# Altium schematic sheet ETHERNET_PHY.SchDoc: ETHERNET PHY
size A3; Author: Arman Arvand; SheetNumber: 13; SheetTotal: 21
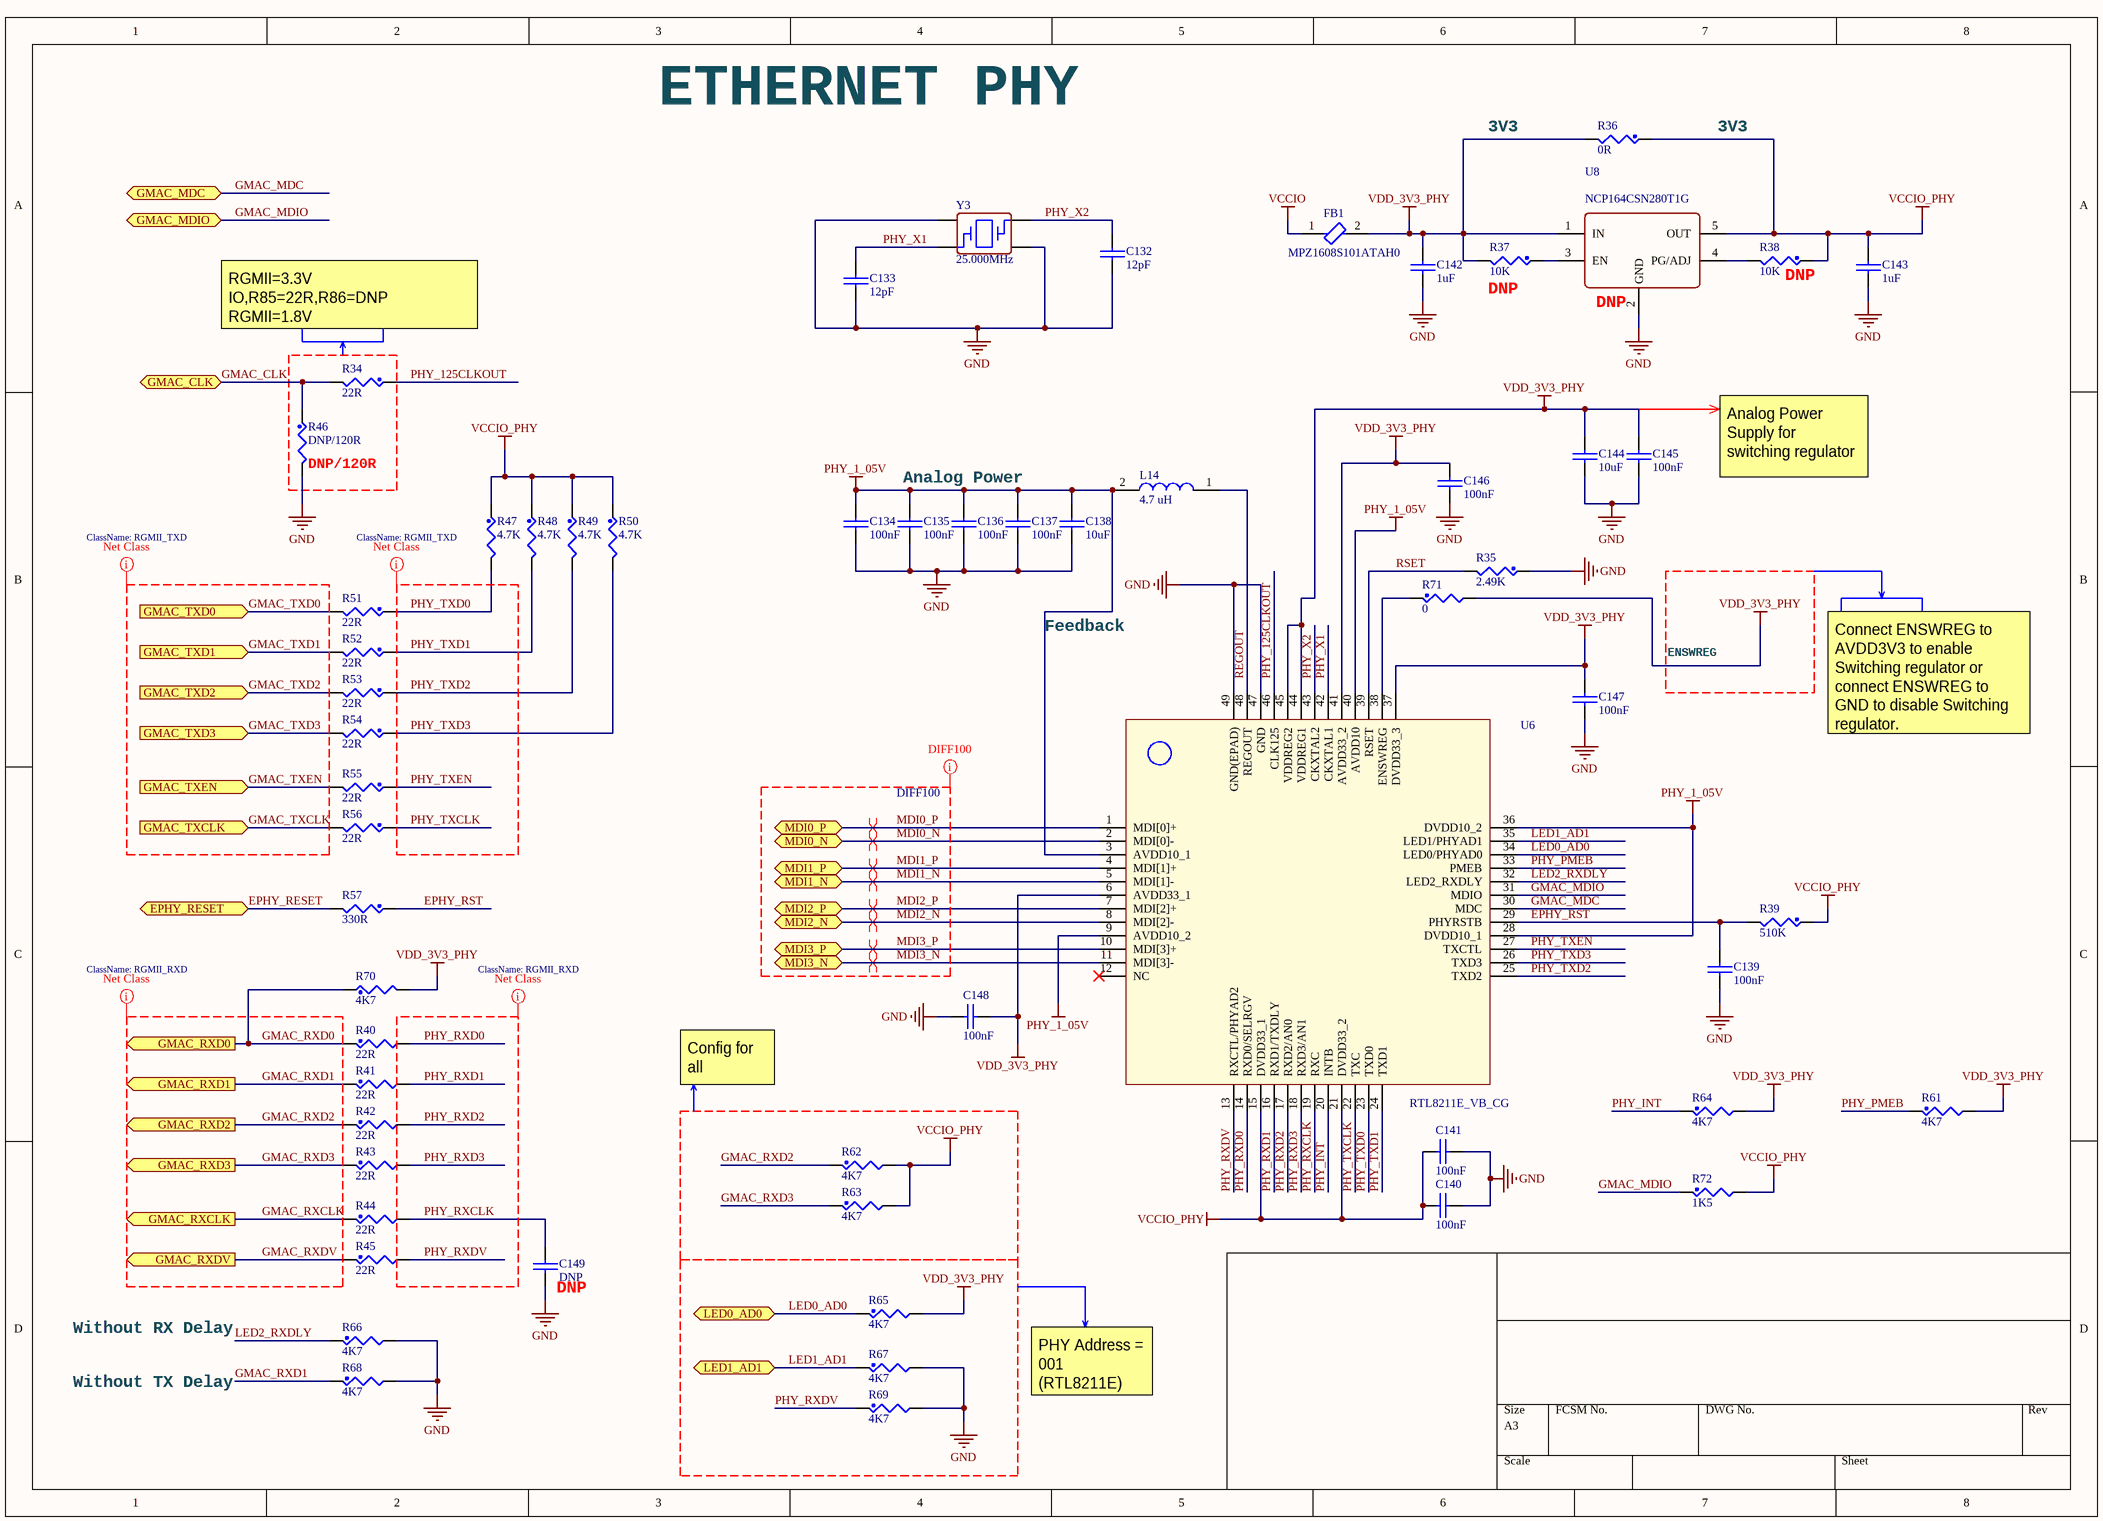
[diagram p0: ETHERNET_PHY.SchDoc]

## Parts
C132  12pF  [0402_CC - C]
C133  12pF  [0402_CC - C]
C134  100nF  [0402_CC - C]
C135  100nF  [0402_CC - C]
C136  100nF  [0402_CC - C]
C137  100nF  [0402_CC - C]
C138  10uF  [0603_CC]
C139  100nF  [0402_CC - C]
C140  100nF  [0402_CC - C]
C141  100nF  [0402_CC - C]
C142  1uF  [0402_CC - C]
C143  1uF  [0402_CC - C]
C144  10uF  [0603_CC]
C145  100nF  [0402_CC - C]
C146  100nF  [0402_CC - C]
C147  100nF  [0402_CC - C]
C148  100nF  [0402_CC - C]
C149  DNP  [0402_CC - C]
FB1  MPZ1608S101ATAH0  [FP-MPZ1608-0_6-IPC_A]
L14  4.7 uH  [1285ASH1R0MP2]
R34  22R  [0402_CR]
R35  2.49K  [0402_CR]
R36  0R  [0402_CR]
R37  10K  [0402_CR]
R38  10K  [0402_CR]
R39  510K  [0402_CR]
R40  22R  [0402_CR]
R41  22R  [0402_CR]
R42  22R  [0402_CR]
R43  22R  [0402_CR]
R44  22R  [0402_CR]
R45  22R  [0402_CR]
R46  DNP/120R  [0402_CR]
R47  4.7K  [0402_CR]
R48  4.7K  [0402_CR]
R49  4.7K  [0402_CR]
R50  4.7K  [0402_CR]
R51  22R  [0402_CR]
R52  22R  [0402_CR]
R53  22R  [0402_CR]
R54  22R  [0402_CR]
R55  22R  [0402_CR]
R56  22R  [0402_CR]
R57  330R  [0402_CR]
R61  4K7  [0402_CR]
R62  4K7  [0402_CR]
R63  4K7  [0402_CR]
R64  4K7  [0402_CR]
R65  4K7  [0402_CR]
R66  4K7  [0402_CR]
R67  4K7  [0402_CR]
R68  4K7  [0402_CR]
R69  4K7  [0402_CR]
R70  4K7  [0402_CR]
R71  0  [0402_CR]
R72  1K5  [0402_CR]
U6  RTL8211E_VB_CG  [QFN40P600X600X100-49N]
U8  NCP164CSN280T1G  [TSOP-5]
Y3  25.000MHz  [ABM8G]

## Blocks framed on the sheet
DNP/120R: R34 R46

## Ports
EPHY_RESET (bidir), GMAC_CLK (bidir), GMAC_MDC (bidir), GMAC_MDIO (bidir), GMAC_RXCLK (out), GMAC_RXD0 (out), GMAC_RXD1 (out), GMAC_RXD2 (out), GMAC_RXD3 (out), GMAC_RXDV (out), GMAC_TXCLK (in), GMAC_TXD0 (in), GMAC_TXD1 (in), GMAC_TXD2 (in), GMAC_TXD3 (in), GMAC_TXEN (in), LED0_AD0 (bidir), LED1_AD1 (bidir), MDI0_N (bidir), MDI0_P (bidir), MDI1_N (bidir), MDI1_P (bidir), MDI2_N (bidir), MDI2_P (bidir), MDI3_N (bidir), MDI3_P (bidir)

## Nets
GND: C132.2 C133.2 C134.2 C135.2 C136.2 C137.2 C138.2 C139.2 C140.2 C141.2 C142.2 C143.2 C144.2 C145.2 C146.1 C147.1 C148.1 C149.1 R35.1 R46.2 R66.2 R67.2 R68.2 R69.2 U6.47(GND) U6.49(GND(EPAD)) U8.2(GND) Y3.2 Y3.4
PHY_1_05V: C134.1 C135.1 C136.1 C137.1 C138.1 L14.2 U6.3(AVDD10_1) U6.9(AVDD10_2) U6.28(DVDD10_1) U6.36(DVDD10_2) U6.40(AVDD10)
VCCIO: FB1.1
VCCIO_PHY: C140.1 C141.1 C143.1 R36.1 R38.1 R39.1 R47.1 R48.1 R49.1 R50.1 R62.2 R63.2 R72.2 U6.15(DVDD33_1) U6.21(DVDD33_2) U8.5(OUT)
VDD_3V3_PHY: C142.1 C144.1 C145.1 C146.2 C147.2 C148.2 FB1.2 R36.2 R37.2 R61.2 R64.2 R65.2 R70.2 R71.2 U6.6(AVDD33_1) U6.37(DVDD33_3) U6.41(AVDD33_2) U6.44(VDDREG1) U6.45(VDDREG2) U8.1(IN)
EPHY_RESET: R57.2 ; port EPHY_RESET
EPHY_RST: C139.1 R39.2 R57.1 U6.29(PHYRSTB)
GMAC_CLK: R34.2 R46.1 ; port GMAC_CLK
GMAC_MDC: U6.30(MDC) ; port GMAC_MDC
GMAC_MDIO: R72.1 U6.31(MDIO) ; port GMAC_MDIO
GMAC_RXCLK: R44.1 ; port GMAC_RXCLK
GMAC_RXD0: R40.1 R70.1 ; port GMAC_RXD0
GMAC_RXD1: R41.1 R68.1 ; port GMAC_RXD1
GMAC_RXD2: R42.1 R62.1 ; port GMAC_RXD2
GMAC_RXD3: R43.1 R63.1 ; port GMAC_RXD3
GMAC_RXDV: R45.1 ; port GMAC_RXDV
GMAC_TXCLK: R56.2 ; port GMAC_TXCLK
GMAC_TXD0: R51.2 ; port GMAC_TXD0
GMAC_TXD1: R52.2 ; port GMAC_TXD1
GMAC_TXD2: R53.2 ; port GMAC_TXD2
GMAC_TXD3: R54.2 ; port GMAC_TXD3
GMAC_TXEN: R55.2 ; port GMAC_TXEN
LED0_AD0: R65.1 U6.34(LED0/PHYAD0) ; port LED0_AD0
LED1_AD1: R67.1 U6.35(LED1/PHYAD1) ; port LED1_AD1
LED2_RXDLY: R66.1 U6.32(LED2_RXDLY)
MDI0_N: U6.2(MDI[0]-) ; port MDI0_N
MDI0_P: U6.1(MDI[0]+) ; port MDI0_P
MDI1_N: U6.5(MDI[1]-) ; port MDI1_N
MDI1_P: U6.4(MDI[1]+) ; port MDI1_P
MDI2_N: U6.8(MDI[2]-) ; port MDI2_N
MDI2_P: U6.7(MDI[2]+) ; port MDI2_P
MDI3_N: U6.11(MDI[3]-) ; port MDI3_N
MDI3_P: U6.10(MDI[3]+) ; port MDI3_P
PHY_125CLKOUT: R34.1 U6.46(CLK125)
PHY_INT: R64.1 U6.20(INTB)
PHY_PMEB: R61.1 U6.33(PMEB)
PHY_RXCLK: C149.2 R44.2 U6.19(RXC)
PHY_RXD0: R40.2 U6.14(RXD0/SELRGV)
PHY_RXD1: R41.2 U6.16(RXD1/TXDLY)
PHY_RXD2: R42.2 U6.17(RXD2/AN0)
PHY_RXD3: R43.2 U6.18(RXD3/AN1)
PHY_RXDV: R45.2 R69.1 U6.13(RXCTL/PHYAD2)
PHY_TXCLK: R56.1 U6.22(TXC)
PHY_TXD0: R47.2 R51.1 U6.23(TXD0)
PHY_TXD1: R48.2 R52.1 U6.24(TXD1)
PHY_TXD2: R49.2 R53.1 U6.25(TXD2)
PHY_TXD3: R50.2 R54.1 U6.26(TXD3)
PHY_TXEN: R55.1 U6.27(TXCTL)
PHY_X1: C133.1 U6.42(CKXTAL1) Y3.1
PHY_X2: C132.1 U6.43(CKXTAL2) Y3.3
REGOUT: L14.1 U6.48(REGOUT)
RSET: R35.2 U6.39(RSET)
NetR37_1: R37.1 U8.3(EN)
NetR38_2: R38.2 U8.4(PG/ADJ)
NetR71_1: R71.1 U6.38(ENSWREG)

Not connected (* = marked no-connect by the designer): U6 12(NC)*

## Layout directives
differential pair: MDI0_N, MDI0_P, MDI1_N, MDI1_P, MDI2_N, MDI2_P, MDI3_N, MDI3_P
net class DIFF100: MDI0_N, MDI0_P, MDI1_N, MDI1_P, MDI2_N, MDI2_P, MDI3_N, MDI3_P
net class RGMII_TXD: GMAC_TXCLK, GMAC_TXD0, GMAC_TXD1, GMAC_TXD2, GMAC_TXD3, GMAC_TXEN, PHY_TXCLK, PHY_TXD0, PHY_TXD1, PHY_TXD2, PHY_TXD3, PHY_TXEN
net class RGMII_RXD: GMAC_RXCLK, GMAC_RXD0, GMAC_RXD1, GMAC_RXD2, GMAC_RXD3, GMAC_RXDV, PHY_RXCLK, PHY_RXD0, PHY_RXD1, PHY_RXD2, PHY_RXD3, PHY_RXDV

## Notes on the sheet
- ETHERNET PHY
- 3V3
- RGMII=3.3V IO,R85=22R,R86=DNP
  RGMII=1.8V IO,R85=100R,R86=120R
- (near R37) DNP
- (near U8) DNP
- (near R38) DNP
- Analog Power
- Analog Power Supply for switching regulator
- Feedback
- ENSWREG
- Connect ENSWREG to AVDD3V3 to enable Switching regulator or connect ENSWREG to GND to disable Switching regulator.
- Config for all capability
- Without RX Delay
- (near C149) DNP
- Without TX Delay
- PHY Address = 001 (RTL8211E)

## Library data of the parts
C132-C149 = CAP_NP: CLASS: DISCRETE
FB1 = MPZ1608S101ATAH0: Ferrite Beads 100ohms 3A 30mOhms 0603 Ferrite Chip / Creator ARMAN; Mfr: TDK; Tolerance: 25%; Impedance: 100R; DC Resistance (DCR): 30mR; Max DC Current: 3A; Packaging: Tape and Reel; Length: 0.063inch; Depth: 0.8mm; Current Rating: 3A; Mount: Surface Mount; Width: 0.031inch; Case Code (Imperial): 0603; Case Code (Metric): 1608; Height: 0.03inch; Core Material: Ferrite; REACH SVHC: No SVHC; Package Quantity: 4000; RoHS Compliant: Yes; Case/Package: 0603; Mfr_Part_No: MPZ1608S101ATAH0; Mouser No: 810-MPZ1608S101ATAH0; Supplier 1: Arrow Electronics; Supplier 2: Mouser; Supplier Part Number 1: MPZ1608S101ATAH0; Supplier Part Number 2: 810-MPZ1608S101ATAH0
L14 = DFE201610E_4R7M_P2_1: Fixed Inductors 08064.7 uH 20% 4.8A RDC=0.032ohms / Creator Arman; Mfr: Murata Electronics; Mfr_Part_No: DFE201610E-4R7M=P2; Datasheet Link: https://psearch.en.murata.com/inductor/product/DFE201610E-4R7M%23.html; Height: 1mm; Mouser N: 81-DFE201610E-4R7MP2; Mouser Price/Stock: https://www.mouser.co.uk/ProductDetail/Murata-Electronics/DFE201610E-4R7M%3dP2?qs=AQlKX63v8RuIglbQNBhlhg%3D%3D; Supplier 1: Digi-Key; Supplier Part Number 1: 490-18108-6-ND; Inductance: 4.7 uH
R34-R57 R61-R72 = RES: CLASS: DISCRETE
U6 = RTL8211E_VB_CG: Ethernet Transceivers 10/100/1000 Base-T PHY GMII, MII, RGMII 1.43V ~ 3.63V QFN-48_6x6x04P Ethernet ICs RoHS / LIBs : By AAR; Mfr_Part_No: RTL8211E-VB-CG; ComponentLink1Description: LCSC; ComponentLink1URL: https://lcsc.com/product-detail/_REALTEK_RTL8211E-VB-CG_RTL8211E-VB-CG_C90735.html?currency=SGD; foot print: QFN-48_6x6x04P; LCSC Part #: C90735; Package: QFN-48_6x6x04P
U8 = NCP164CSN280T1G: LDO Regulator, 300mA, / Low Dropout Voltage, Ultra / Low Noise, High PSRR with / Power Good; Mfr: ON Semiconductor; Output Voltage: 2.8V; Height: 1.1mm; Mfr_Part_No: NCP164CSN280T1G; Mouser No: 863-NCP164CSN280T1G; Output Current: 300mA; Supplier 1: DigiKey; Supplier 2: Mouser; Supplier 3: DigiKey; Supplier 4: Mouser; Supplier 5: Digi-Key; Supplier 6: Mouser; Supplier Part Number 1: 488-NCP164CSN180T1GTR-ND; Supplier Part Number 2: 863-NCP164CSN180T1G; Supplier Part Number 3: 488-NCP164CSN180T1GTR-ND; Supplier Part Number 4: 863-NCP164CSN180T1G; Supplier Part Number 5: 488-NCP164CSN280T1GCT-ND; Supplier Part Number 6: 863-NCP164CSN280T1G
Y3 = ABM8G-25.000MHZ-18-D2Y-T: CRYSTAL 25MHZ 18PF SMD / Created by Arman Arvand; Mfr: Abracon Corporation; Frequency Stability: ±30ppm; Frequency Tolerance: ±20ppm; ESR (Equivalent Series Resistance): 60 Ohm; Operating Mode: Fundamental; Mfr_Part_No: ABM8G-25.000MHZ-18-D2Y-T; RoHS: RoHS Compliant; Category: Crystals and Oscillators; Stock 1: 25549; Pricing 1: 1=1.06, 10=0.944, 50=0.8814, 100=0.78, 500=0.7371 (USD); Packaging: Cut Tape (CT); Type: MHz Crystal; Frequency: 25MHz; Load Capacitance: 18pF; Operating Temperature: -40°C ~ 85°C; Ratings: -; Mounting Type: Surface Mount; Package / Case: 4-SMD, No Lead (DFN, LCC); Size / Dimension: 0.126" L x 0.098" W (3.20mm x 2.50mm); Height: 0.039" (1.00mm); ComponentLink1URL: http://www.abracon.com/Resonators/ABM8G.pdf; ComponentLink1Description: http://www.abracon.com/Resonators/ABM8G.pdf; Supplier 1: Digi-Key; Supplier 2: Newark; Supplier Part Number 1: 535-10275-1-ND; Supplier Part Number 2: 29AC2068